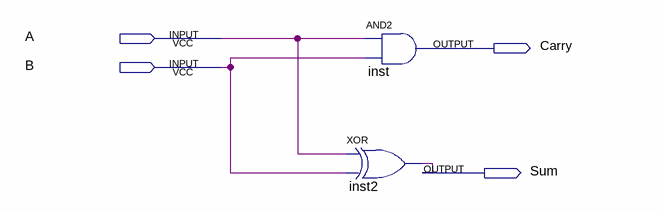
[diagram p0: schematic sheet]
// Quartus schematic half_adder.bdf as structural Verilog: 2 symbols, 4 pins
module half_adder (
  input  A,
  input  B,
  output Carry,
  output Sum
);

  and inst (Carry, A, B);
  xor inst2 (Sum, A, B);
endmodule
